# Altium schematic sheet Revision.SchDoc
size A4; Author: Audran; CompanyName: Goldorak; Address1: Electrolab; Address2: 52 rue Paul Lescop; Address3: 92000 Nanterre; ProjectName: Cartes_2017
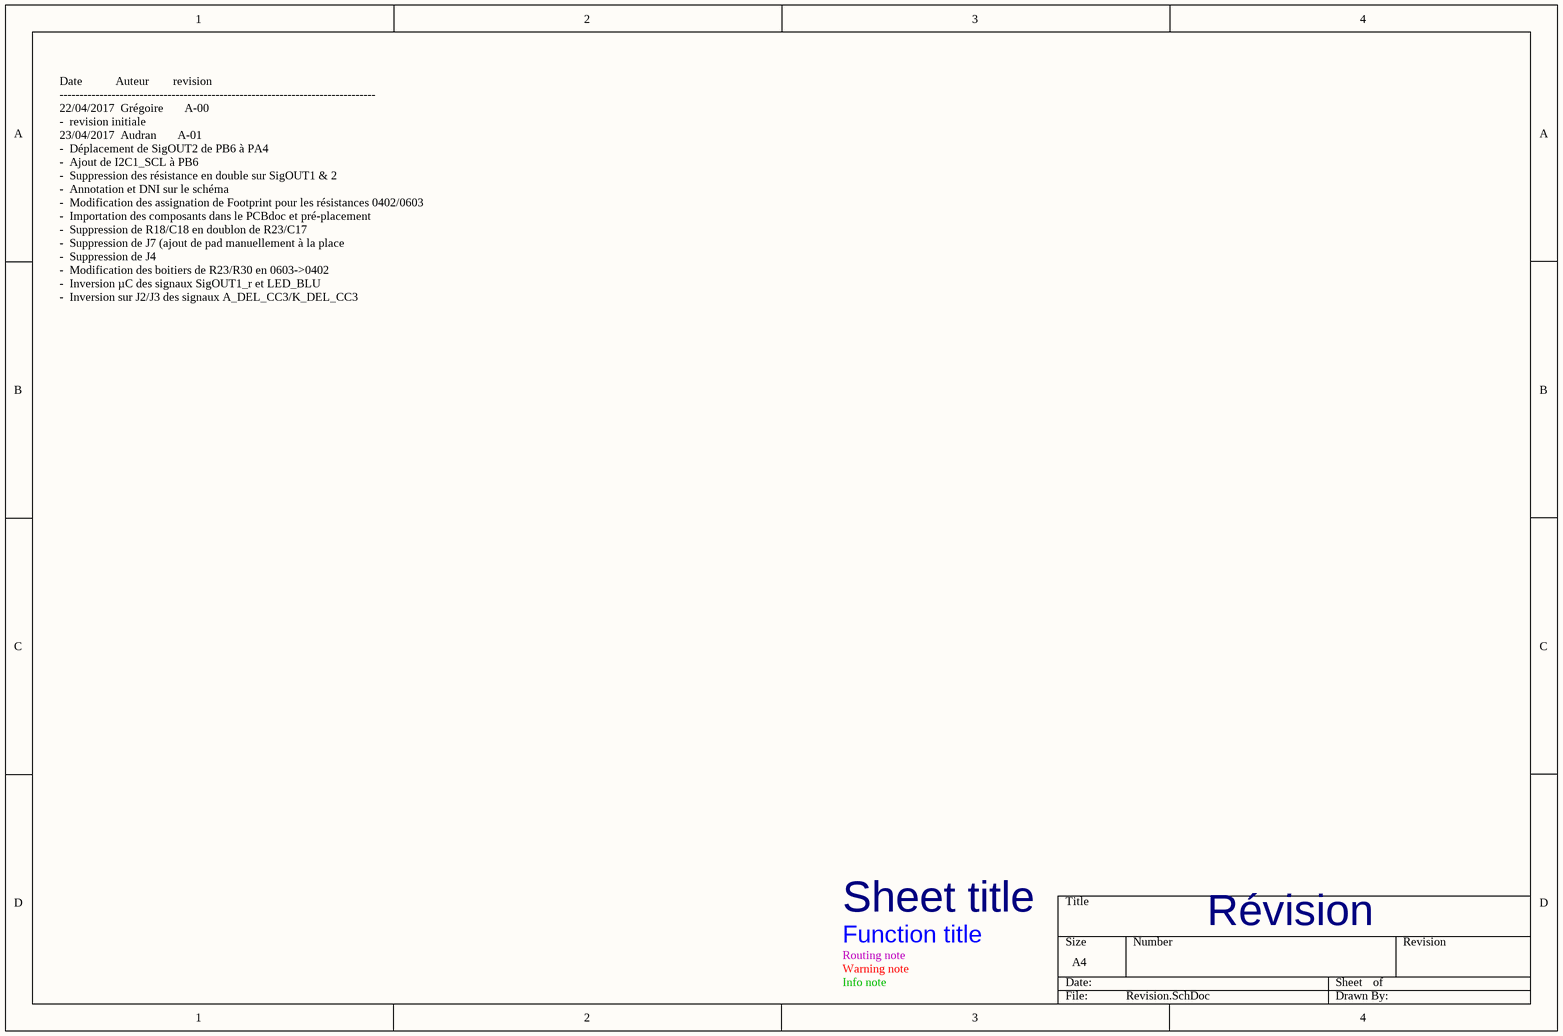
[diagram p0: Revision.SchDoc]

## Notes on the sheet
- Date           Auteur        revision
  -------------------------------------------------------------------------------
  22/04/2017  Grégoire       A-00
  -  revision initiale
  23/04/2017  Audran       A-01
  -  Déplacement de SigOUT2 de PB6 à PA4
  -  Ajout de I2C1_SCL à PB6
  -  Suppression des résistance en double sur SigOUT1 & 2
  -  Annotation et DNI sur le schéma
  -  Modification des assignation de Footprint pour les résistances 0402/0603
  -  Importation des composants dans le PCBdoc et pré-placement
  -  Suppression de R18/C18 en doublon de R23/C17
  -  Suppression de J7 (ajout de pad manuellement à la place
  -  Suppression de J4
  -  Modification des boitiers de R23/R30 en 0603->0402
  -  Inversion µC des signaux SigOUT1_r et LED_BLU
  -  Inversion sur J2/J3 des signaux A_DEL_CC3/K_DEL_CC3
- Sheet title
- Routing note
- Warning note
- Info note
- Function title
- Révision